# Altium project ZX_UNO_Aplus2.PrjPcb
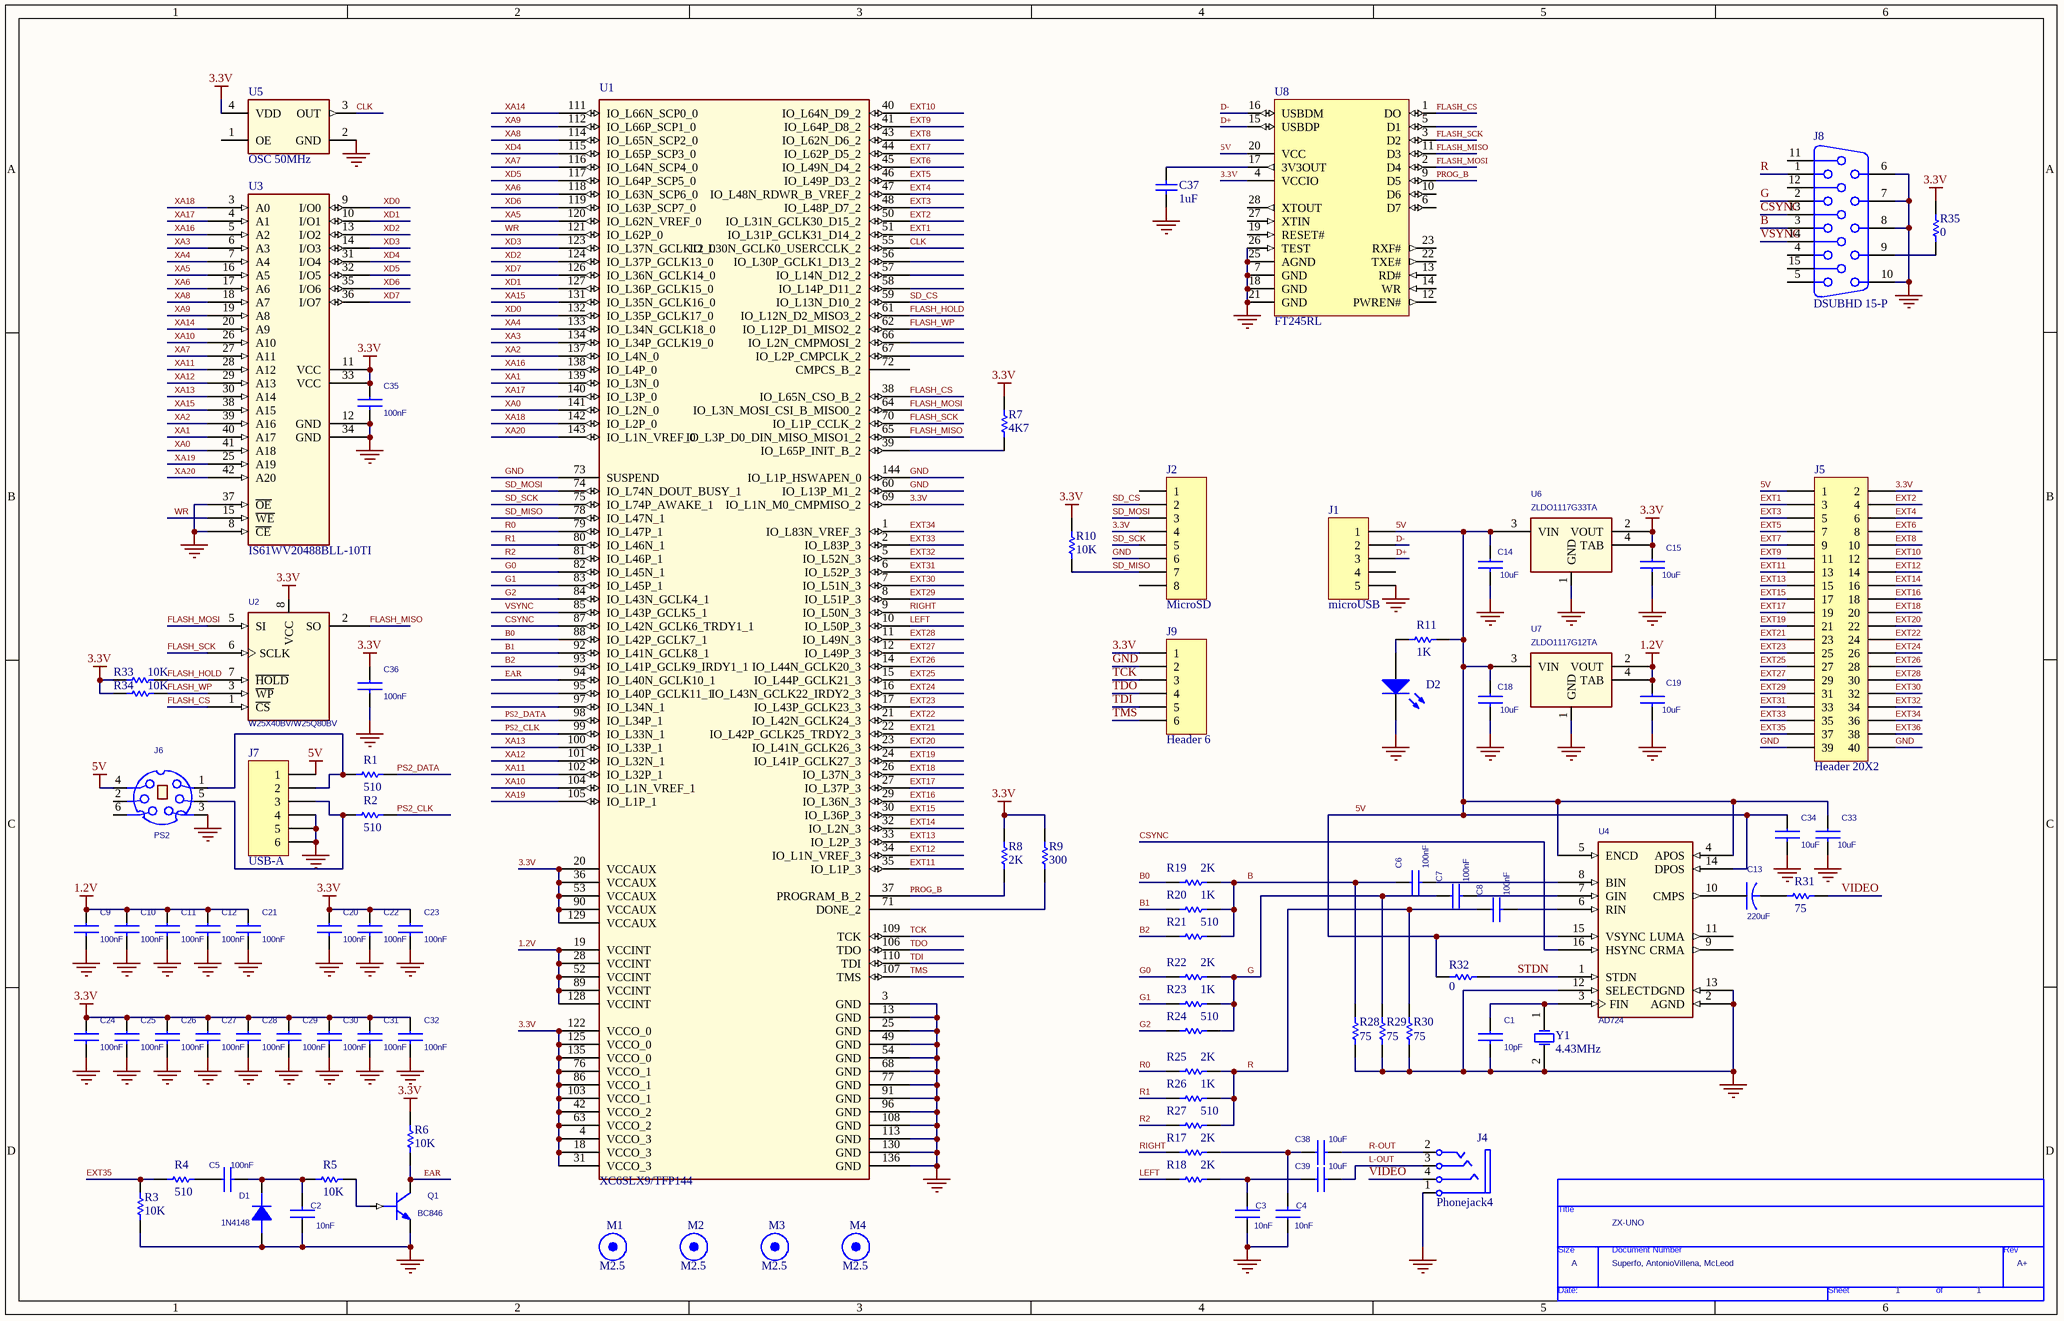
[diagram p0: ZX_UNO_Aplus2.SchDoc]
1 sheet, 92 parts. Net scope: global (net labels, ports and power ports of the same name join across sheets).
Board file: ZX_UNO_Aplus2.PcbDoc

## Sheet ZX_UNO_Aplus2.SchDoc
size 386 x 246 mm

### Parts
*  Page Count: 1  Page Size: A  Title: ZX-UNO  RevCode: A+  Doc: Superfo, AntonioVillena, McLeod  (hidden comment: TitleBlock0)  (graphical)
C1  10pF  [SM/C_0805]
C2  10nF  [SM/C_0805]
C3  10nF  [SM/C_0805]
C4  10nF  [SM/C_0805]
C5  100nF  [SM/C_0603]
C6  100nF  [SM/C_0603]
C7  100nF  [SM/C_0603]
C8  100nF  [SM/C_0603]
C9  100nF  [SM/C_0603]
C10  100nF  [SM/C_0603]
C11  100nF  [SM/C_0603]
C12  100nF  [SM/C_0603]
C13  220uF  [CYL/D.250/LS.150/.031]
C14  10uF  [SM/C_0805]
C15  10uF  [SM/C_0805]
C18  10uF  [SM/C_0805]
C19  10uF  [SM/C_0805]
C20  100nF  [SM/C_0603]
C21  100nF  [SM/C_0603]
C22  100nF  [SM/C_0603]
C23  100nF  [SM/C_0603]
C24  100nF  [SM/C_0603]
C25  100nF  [SM/C_0603]
C26  100nF  [SM/C_0603]
C27  100nF  [SM/C_0603]
C28  100nF  [SM/C_0603]
C29  100nF  [SM/C_0603]
C30  100nF  [SM/C_0603]
C31  100nF  [SM/C_0603]
C32  100nF  [SM/C_0603]
C33  10uF  [SM/C_0805]
C34  10uF  [SM/C_0805]
C35  100nF  [SM/C_0603]
C36  100nF  [SM/C_0603]
C37  value 1uF  [SM/C_0805]  (hidden comment: Cap)
C38  10uF  [SM/C_0805]
C39  10uF  [SM/C_0805]
D1  1N4148  [SM/D_0805_21]
D2  LED0  [SM/LED_0603_21]  (value not drawn)
J1  microUSB  [MICRO USB]
J2  MicroSD  [SD HR1941CT-ND]
J4  Phonejack4  [AUDIO JACK PJ-322]
J5  Header 20X2  [HDR2X20]
J6  PS2  [DINC/MIN_TM/6]
J7  USB-A  [USB A]
J8  DSUBHD 15-P  [DSUB/RP/SM/15]
J9  Header 6  [HDR1X6]
M1  M2.5  [M2.5]
M2  M2.5  [M2.5]
M3  M2.5  [M2.5]
M4  M2.5  [M2.5]
Q1  BC846  [SM/SOT23_231]
R1  value 510  [SM/R_0805]  (hidden comment: Res1)
R2  value 510  [SM/R_0805]  (hidden comment: Res1)
R3  value 10K  [SM/R_0805]  (hidden comment: Res1)
R4  value 510  [SM/R_0805]  (hidden comment: Res1)
R5  value 10K  [SM/R_0805]  (hidden comment: Res1)
R6  value 10K  [SM/R_0805]  (hidden comment: Res1)
R7  value 4K7  [SM/R_0805]  (hidden comment: Res1)
R8  value 2K  [SM/R_0805]  (hidden comment: Res1)
R9  value 300  [SM/R_0805]  (hidden comment: Res1)
R10  value 10K  [SM/R_0805]  (hidden comment: Res1)
R11  value 1K  [SM/R_0805]  (hidden comment: Res1)
R17  value 2K  [SM/R_0805]  (hidden comment: Res1)
R18  value 2K  [SM/R_0805]  (hidden comment: Res1)
R19  value 2K  [SM/R_0805]  (hidden comment: Res1)
R20  value 1K  [SM/R_0805]  (hidden comment: Res1)
R21  value 510  [SM/R_0805]  (hidden comment: Res1)
R22  value 2K  [SM/R_0805]  (hidden comment: Res1)
R23  value 1K  [SM/R_0805]  (hidden comment: Res1)
R24  value 510  [SM/R_0805]  (hidden comment: Res1)
R25  value 2K  [SM/R_0805]  (hidden comment: Res1)
R26  value 1K  [SM/R_0805]  (hidden comment: Res1)
R27  value 510  [SM/R_0805]  (hidden comment: Res1)
R28  value 75  [SM/R_0805]  (hidden comment: Res1)
R29  value 75  [SM/R_0805]  (hidden comment: Res1)
R30  value 75  [SM/R_0805]  (hidden comment: Res1)
R31  value 75  [SM/R_0805]  (hidden comment: Res1)
R32  value 0  [SM/R_0805]  (hidden comment: Res1)
R33  value 10K  [SM/R_0805]  (hidden comment: Res1)
R34  value 10K  [SM/R_0805]  (hidden comment: Res1)
R35  value 0  [SM/R_0805]  (hidden comment: Res1)
U1  XC6SLX9/TFP144
U2  W25X40BV/W25Q80BV  [SOJ.050/8/WB.300/L.200]
U3  IS61WV20488BLL-10TI  [SOP80P1176-44M]
U4  AD724  [SOJ.050/16/WB.400/L.400]
U5  OSC 50MHz  [SM/OSC]
U6  ZLDO1117G33TA  [SM/SOT223]
U7  ZLDO1117G12TA  [SM/SOT223]
U8  FT245RL  [SOP65P780-28N]
Y1  4.43MHz  [XTAL]

### Nets
1.2V: C9.1 C10.1 C11.1 C12.1 C19.1 C21.1 U1.19(VCCINT) U1.28(VCCINT) U1.52(VCCINT) U1.89(VCCINT) U1.128(VCCINT) U7.2(VOUT) U7.4(TAB)
3.3V: C15.1 C20.1 C22.1 C23.1 C24.1 C25.1 C26.1 C27.1 C28.1 C29.1 C30.1 C31.1 C32.1 C35.1 C36.1 J2.4 J5.2 J9.1 R6.1 R7.2 R8.2 R9.2 R10.2 R33.1 R34.1 R35.1 U1.4(VCCO_3) U1.18(VCCO_3) U1.20(VCCAUX) U1.31(VCCO_3) U1.36(VCCAUX) U1.42(VCCO_2) U1.53(VCCAUX) U1.63(VCCO_2) U1.69(IO_L1N_M0_CMPMISO_2) U1.76(VCCO_1) U1.86(VCCO_1) U1.90(VCCAUX) U1.103(VCCO_1) U1.122(VCCO_0) U1.125(VCCO_0) U1.129(VCCAUX) U1.135(VCCO_0) U2.8(VCC) U3.11(VCC) U3.33(VCC) U5.4(VDD) U6.2(VOUT) U6.4(TAB) U8.4(VCCIO)
5V: C14.1 C18.1 C33.1 C34.1 J1.1 J5.1 J6.4 J7.1 R11.1 R32.2 U4.4(APOS) U4.5(ENCD) U4.14(DPOS) U4.15(VSYNC) U6.3(VIN) U7.3(VIN) U8.20(VCC)
GND: C1.2 C2.1 C3.1 C4.1 C9.2 C10.2 C11.2 C12.2 C14.2 C15.2 C18.2 C19.2 C20.2 C21.2 C22.2 C23.2 C24.2 C25.2 C26.2 C27.2 C28.2 C29.2 C30.2 C31.2 C32.2 C33.2 C34.2 C35.2 C36.2 C37.2 D1.1(A) D2.2(K) J1.5 J2.6 J4.1(S) J5.39 J5.40 J6.3 J6.M1(GND) J6.M2(GND) J6.M3(GND) J7.4 J7.5 J7.6 J8.6 J8.7 J8.8 J8.10 J9.2 Q1.3(EMITTER) R3.2 R28.1 R29.1 R30.1 U1.3(GND) U1.13(GND) U1.25(GND) U1.49(GND) U1.54(GND) U1.60(IO_L13P_M1_2) U1.68(GND) U1.73(SUSPEND) U1.77(GND) U1.91(GND) U1.96(GND) U1.108(GND) U1.113(GND) U1.130(GND) U1.136(GND) U1.144(IO_L1P_HSWAPEN_0) U2.4(GND) U3.8(~{CE}) U3.12(GND) U3.34(GND) U3.37(~{OE}) U4.2(AGND) U4.12(SELECT) U4.13(DGND) U5.2(GND) U6.1(GND) U7.1(GND) U8.7(GND) U8.18(GND) U8.21(GND) U8.25(AGND) U8.26(TEST) Y1.2(OSC2)
B: C6.1 J8.3 R19.2 R20.2 R21.2 R28.2
B0: R19.1 U1.88(IO_L42P_GCLK7_1)
B1: R20.1 U1.92(IO_L41N_GCLK8_1)
B2: R21.1 U1.93(IO_L41P_GCLK9_IRDY1_1)
CLK: U1.55(IO_L30N_GCLK0_USERCCLK_2) U5.3(OUT)
CSYNC: J8.13 U1.87(IO_L42N_GCLK6_TRDY1_1) U4.16(HSYNC)
D+: J1.3 U8.15(USBDP)
D-: J1.2 U8.16(USBDM)
EAR: Q1.1(COLLECTOR) R6.2 U1.94(IO_L40N_GCLK10_1)
EXT1: J5.3 U1.51(IO_L31P_GCLK31_D14_2)
EXT2: J5.4 U1.50(IO_L31N_GCLK30_D15_2)
EXT3: J5.5 U1.48(IO_L48P_D7_2)
EXT4: J5.6 U1.47(IO_L48N_RDWR_B_VREF_2)
EXT5: J5.7 U1.46(IO_L49P_D3_2)
EXT6: J5.8 U1.45(IO_L49N_D4_2)
EXT7: J5.9 U1.44(IO_L62P_D5_2)
EXT8: J5.10 U1.43(IO_L62N_D6_2)
EXT9: J5.11 U1.41(IO_L64P_D8_2)
EXT10: J5.12 U1.40(IO_L64N_D9_2)
EXT11: J5.13 U1.35(IO_L1P_3)
EXT12: J5.14 U1.34(IO_L1N_VREF_3)
EXT13: J5.15 U1.33(IO_L2P_3)
EXT14: J5.16 U1.32(IO_L2N_3)
EXT15: J5.17 U1.30(IO_L36P_3)
EXT16: J5.18 U1.29(IO_L36N_3)
EXT17: J5.19 U1.27(IO_L37P_3)
EXT18: J5.20 U1.26(IO_L37N_3)
EXT19: J5.21 U1.24(IO_L41P_GCLK27_3)
EXT20: J5.22 U1.23(IO_L41N_GCLK26_3)
EXT21: J5.23 U1.22(IO_L42P_GCLK25_TRDY2_3)
EXT22: J5.24 U1.21(IO_L42N_GCLK24_3)
EXT23: J5.25 U1.17(IO_L43P_GCLK23_3)
EXT24: J5.26 U1.16(IO_L43N_GCLK22_IRDY2_3)
EXT25: J5.27 U1.15(IO_L44P_GCLK21_3)
EXT26: J5.28 U1.14(IO_L44N_GCLK20_3)
EXT27: J5.29 U1.12(IO_L49P_3)
EXT28: J5.30 U1.11(IO_L49N_3)
EXT29: J5.31 U1.8(IO_L51P_3)
EXT30: J5.32 U1.7(IO_L51N_3)
EXT31: J5.33 U1.6(IO_L52P_3)
EXT32: J5.34 U1.5(IO_L52N_3)
EXT33: J5.35 U1.2(IO_L83P_3)
EXT34: J5.36 U1.1(IO_L83N_VREF_3)
EXT35: J5.37 R3.1 R4.1
EXT36: J5.38
FLASH_CS: U1.38(IO_L65N_CSO_B_2) U2.1(~{CS}) U8.1(DO)
FLASH_HOLD: R33.2 U1.61(IO_L12N_D2_MISO3_2) U2.7(~{HOLD})
FLASH_MISO: U1.65(IO_L3P_D0_DIN_MISO_MISO1_2) U2.2(SO) U8.11(D3)
FLASH_MOSI: U1.64(IO_L3N_MOSI_CSI_B_MISO0_2) U2.5(SI) U8.2(D4)
FLASH_SCK: U1.70(IO_L1P_CCLK_2) U2.6(SCLK) U8.3(D2)
FLASH_WP: R34.2 U1.62(IO_L12P_D1_MISO2_2) U2.3(~{WP})
G: C7.1 J8.2 R22.2 R23.2 R24.2 R29.2
G0: R22.1 U1.82(IO_L45N_1)
G1: R23.1 U1.83(IO_L45P_1)
G2: R24.1 U1.84(IO_L43N_GCLK4_1)
L-OUT: C39.2 J4.3(RN)
LEFT: R18.1 U1.10(IO_L50P_3)
PROG_B: R8.1 U1.37(PROGRAM_B_2) U8.9(D5)
PS2_CLK: R2.2 U1.99(IO_L33N_1)
PS2_DATA: R1.2 U1.98(IO_L34P_1)
R: C8.1 J8.1 R25.2 R26.2 R27.2 R30.2
R0: R25.1 U1.79(IO_L47P_1)
R1: R26.1 U1.80(IO_L46N_1)
R2: R27.1 U1.81(IO_L46P_1)
R-OUT: C38.2 J4.2(T)
RIGHT: R17.1 U1.9(IO_L50N_3)
SD_CS: J2.2 U1.59(IO_L13N_D10_2)
SD_MISO: J2.7 R10.1 U1.78(IO_L47N_1)
SD_MOSI: J2.3 U1.74(IO_L74N_DOUT_BUSY_1)
SD_SCK: J2.5 U1.75(IO_L74P_AWAKE_1)
STDN: R32.1 U4.1(STDN)
TCK: J9.3 U1.109(TCK)
TDI: J9.5 U1.110(TDI)
TDO: J9.4 U1.106(TDO)
TMS: J9.6 U1.107(TMS)
VIDEO: J4.4(R) R31.2
VSYNC: J8.14 U1.85(IO_L43P_GCLK5_1)
WR: U1.121(IO_L62P_0) U3.15(~{WE})
XA0: U1.141(IO_L2N_0) U3.41(A18)
XA1: U1.139(IO_L3N_0) U3.40(A17)
XA2: U1.137(IO_L4N_0) U3.39(A16)
XA3: U1.134(IO_L34P_GCLK19_0) U3.6(A3)
XA4: U1.133(IO_L34N_GCLK18_0) U3.7(A4)
XA5: U1.120(IO_L62N_VREF_0) U3.16(A5)
XA6: U1.118(IO_L63N_SCP6_0) U3.17(A6)
XA7: U1.116(IO_L64N_SCP4_0) U3.27(A11)
XA8: U1.114(IO_L65N_SCP2_0) U3.18(A7)
XA9: U1.112(IO_L66P_SCP1_0) U3.19(A8)
XA10: U1.104(IO_L1N_VREF_1) U3.26(A10)
XA11: U1.102(IO_L32P_1) U3.28(A12)
XA12: U1.101(IO_L32N_1) U3.29(A13)
XA13: U1.100(IO_L33P_1) U3.30(A14)
XA14: U1.111(IO_L66N_SCP0_0) U3.20(A9)
XA15: U1.131(IO_L35N_GCLK16_0) U3.38(A15)
XA16: U1.138(IO_L4P_0) U3.5(A2)
XA17: U1.140(IO_L3P_0) U3.4(A1)
XA18: U1.142(IO_L2P_0) U3.3(A0)
XA19: U1.105(IO_L1P_1) U3.25(A19)
XA20: U1.143(IO_L1N_VREF_0) U3.42(A20)
XD0: U1.132(IO_L35P_GCLK17_0) U3.9(I/O0)
XD1: U1.127(IO_L36P_GCLK15_0) U3.10(I/O1)
XD2: U1.124(IO_L37P_GCLK13_0) U3.13(I/O2)
XD3: U1.123(IO_L37N_GCLK12_0) U3.14(I/O3)
XD4: U1.115(IO_L65P_SCP3_0) U3.31(I/O4)
XD5: U1.117(IO_L64P_SCP5_0) U3.32(I/O5)
XD6: U1.119(IO_L63P_SCP7_0) U3.35(I/O6)
XD7: U1.126(IO_L36N_GCLK14_0) U3.36(I/O7)
NetC1_1: C1.1 U4.3(FIN) Y1.1(OSC1)
NetC2_2: C2.2 C5.2 D1.2(K) R5.1
NetC3_2: C3.2 C39.1 R18.2
NetC4_2: C4.2 C38.1 R17.2
NetC5_1: C5.1 R4.2
NetC6_2: C6.2 U4.8(BIN)
NetC7_2: C7.2 U4.7(GIN)
NetC8_2: C8.2 U4.6(RIN)
NetC13_1: C13.1 U4.10(CMPS)
NetC13_2: C13.2 R31.1
NetC37_1: C37.1 U8.17(3V3OUT)
NetD2_1: D2.1(A) R11.2
NetJ6_1: J6.1 J7.2 R1.1
NetJ6_5: J6.5 J7.3 R2.1
NetJ8_9: J8.9 R35.2
NetQ1_2: Q1.2(BASE) R5.2
NetR7_1: R7.1 U1.39(IO_L65P_INIT_B_2)
NetR9_1: R9.1 U1.71(DONE_2)

Not connected (* = marked no-connect by the designer): J1 4; J2 1 8; J6 2 6; J8 4 5 11 12 15; U1 56(IO_L30P_GCLK1_D13_2) 57(IO_L14N_D12_2) 58(IO_L14P_D11_2) 66(IO_L2N_CMPMOSI_2) 67(IO_L2P_CMPCLK_2) 72(CMPCS_B_2) 95(IO_L40P_GCLK11_1) 97(IO_L34N_1); U4 9(CRMA) 11(LUMA); U5 1(OE); U8 5(D1) 6(D7) 10(D6) 12(PWREN#) 13(RD#) 14(WR) 19(RESET#) 22(TXE#) 23(RXF#) 27(XTIN) 28(XTOUT)

### Notes on the sheet
- (in symbol TitleBlock0) Title; Size; Document Number; Rev; Date:; Sheet; of

### Library data of the parts
C1-C5 C7 C36 = CAP NP: COMPHEIGHT: 0.000; MEMORY: NO; COMPGROUP: 0; COMPLOC: [1025.000,1280.000]; COMPSIDE: BOT; FPLIST: SM/C_0603_VIA,SM/C_0805,SM/C_0603; DECOUPLER: NO; COMPKEY: NO; COMPLOCKED: NO; COMPFIXED: NO; COMPROT: 0
C6 C8 = CAP NP: FPLIST: SM/C_0603_VIA,SM/C_0805,SM/C_0603; COMPSIDE: BOT; COMPLOC: [1025.000,1280.000]; COMPROT: 0; COMPFIXED: NO; COMPHEIGHT: 0.000; COMPGROUP: 0; COMPLOCKED: NO; COMPKEY: NO; DECOUPLER: NO; MEMORY: NO
C9 = CAP NP: FPLIST: SM/C_0603_VIA,SM/C_0805,SM/C_0603,SM/C_0603_VIA1; COMPSIDE: BOT; COMPLOC: [1820.000,1500.000]; COMPROT: 180; COMPGROUP: 0; COMPFIXED: NO; COMPHEIGHT: 0.000; COMPLOCKED: NO; COMPKEY: NO; DECOUPLER: NO; MEMORY: NO
C10 = CAP NP: FPLIST: SM/C_0805,SM/C_0603; COMPSIDE: BOT; COMPLOC: [1255.000,1345.000]; COMPROT: 90; COMPGROUP: 0; COMPFIXED: NO; COMPHEIGHT: 0.000; COMPLOCKED: NO; COMPKEY: NO; DECOUPLER: NO; MEMORY: NO
C11 = CAP NP: FPLIST: SM/C_0603,SM/C_0805,SM/C_0603_VIA; COMPSIDE: BOT; COMPLOC: [1440.000,795.000]; COMPROT: 180; COMPGROUP: 0; COMPFIXED: NO; COMPHEIGHT: 0.000; COMPLOCKED: NO; COMPKEY: NO; DECOUPLER: NO; MEMORY: NO
C12 = CAP NP: FPLIST: SM/C_0805,SM/C_0603,SM/C_0603_VIA,SM/C_0603_VIA1,SM/C_0603_VIA2; COMPSIDE: BOT; COMPLOC: [1965.000,916.000]; COMPROT: 90; COMPGROUP: 0; COMPFIXED: NO; COMPHEIGHT: 0.000; COMPLOCKED: NO; COMPKEY: NO; DECOUPLER: NO; MEMORY: NO
C13 = CAP: COMPSIDE: TOP; COMPLOC: [2160.000,2000.000]; COMPROT: 270; COMPGROUP: 0; COMPFIXED: NO; COMPHEIGHT: 0.000; COMPLOCKED: NO; COMPKEY: NO; DECOUPLER: NO; MEMORY: NO
C14 = CAP NP: COMPHEIGHT: 0.000; MEMORY: NO; COMPGROUP: 0; COMPLOC: [340.000,620.000]; COMPSIDE: TOP; FPLIST: SM/C_0805_VIA,SM/C_0805_VIA1,SM/C_0603,SM/C_0805; DECOUPLER: NO; COMPKEY: NO; COMPLOCKED: NO; COMPFIXED: NO; COMPROT: 0
C15 = CAP NP: FPLIST: SM/C_0805,SM/C_0603_VIA,SM/C_0603,SM/C_0805_VIA; COMPSIDE: TOP; COMPLOC: [250.000,620.000]; COMPROT: 180; COMPGROUP: 0; COMPFIXED: NO; COMPHEIGHT: 0.000; COMPLOCKED: NO; COMPKEY: NO; DECOUPLER: NO; MEMORY: NO
C18 = CAP NP: COMPHEIGHT: 0.000; MEMORY: NO; COMPGROUP: 0; COMPLOC: [1485.000,1660.000]; COMPSIDE: BOT; FPLIST: SM/C_0805_VIA2,SM/C_0805_VIA,SM/C_0805_VIA1,SM/C_0603,SM/C_0805; DECOUPLER: NO; COMPKEY: NO; COMPLOCKED: NO; COMPFIXED: NO; COMPROT: 0
C19 = CAP NP: FPLIST: SM/C_0805_VIA2,SM/C_0805,SM/C_0603_VIA,SM/C_0603,SM/C_0805_VIA; COMPSIDE: BOT; COMPLOC: [1575.000,1660.000]; COMPROT: 180; COMPGROUP: 0; COMPFIXED: NO; COMPHEIGHT: 0.000; COMPLOCKED: NO; COMPKEY: NO; DECOUPLER: NO; MEMORY: NO
C20 = CAP NP: FPLIST: SM/C_0603_VIA,SM/C_0603,SM/C_0805,SM/C_0603_VIA1; COMPSIDE: BOT; COMPLOC: [1345.000,1500.000]; COMPROT: 0; COMPFIXED: NO; COMPHEIGHT: 0.000; COMPGROUP: 0; COMPLOCKED: NO; COMPKEY: NO; DECOUPLER: NO; MEMORY: NO
C21 = CAP NP: FPLIST: SM/C_0805,SM/C_0603,SM/C_0603_VIA; COMPSIDE: BOT; COMPLOC: [1255.000,910.000]; COMPROT: 90; COMPGROUP: 0; COMPFIXED: NO; COMPHEIGHT: 0.000; COMPLOCKED: NO; COMPKEY: NO; DECOUPLER: NO; MEMORY: NO
C22 = CAP NP: FPLIST: SM/C_0805,SM/C_0603,SM/C_0603_VIA; COMPSIDE: BOT; COMPLOC: [1874.000,795.000]; COMPROT: 180; COMPGROUP: 0; COMPFIXED: NO; COMPHEIGHT: 0.000; COMPLOCKED: NO; COMPKEY: NO; DECOUPLER: NO; MEMORY: NO
C23 = CAP NP: FPLIST: SM/C_0603,SM/C_0805; COMPSIDE: BOT; COMPLOC: [1965.000,1335.000]; COMPROT: 90; COMPGROUP: 0; COMPFIXED: NO; COMPHEIGHT: 0.000; COMPLOCKED: NO; COMPKEY: NO; DECOUPLER: NO; MEMORY: NO
C24 = CAP NP: FPLIST: SM/C_0603_VIA1,SM/C_0603,SM/C_0805,SM/C_0603_VIA; COMPSIDE: BOT; COMPLOC: [1695.000,1500.000]; COMPROT: 180; COMPGROUP: 0; COMPFIXED: NO; COMPHEIGHT: 0.000; COMPLOCKED: NO; COMPKEY: NO; DECOUPLER: NO; MEMORY: NO
C25 = CAP NP: FPLIST: SM/C_0805,SM/C_0603; COMPSIDE: BOT; COMPLOC: [1415.000,1500.000]; COMPROT: 180; COMPGROUP: 0; COMPFIXED: NO; COMPHEIGHT: 0.000; COMPLOCKED: NO; COMPKEY: NO; DECOUPLER: NO; MEMORY: NO
C26 = CAP NP: FPLIST: SM/C_0805,SM/C_0603; COMPSIDE: BOT; COMPLOC: [1375.000,795.000]; COMPROT: 0; COMPFIXED: NO; COMPHEIGHT: 0.000; COMPGROUP: 0; COMPLOCKED: NO; COMPKEY: NO; DECOUPLER: NO; MEMORY: NO
C27 = CAP NP: FPLIST: SM/C_0603,SM/C_0805; COMPSIDE: BOT; COMPLOC: [1255.000,985.000]; COMPROT: 270; COMPGROUP: 0; COMPFIXED: NO; COMPHEIGHT: 0.000; COMPLOCKED: NO; COMPKEY: NO; DECOUPLER: NO; MEMORY: NO
C28 = CAP NP: FPLIST: SM/C_0603,SM/C_0805,SM/C_0603_VIA; COMPSIDE: BOT; COMPLOC: [1695.000,1325.000]; COMPROT: 0; COMPFIXED: NO; COMPHEIGHT: 0.000; COMPGROUP: 0; COMPLOCKED: NO; COMPKEY: NO; DECOUPLER: NO; MEMORY: NO
C29 = CAP NP: FPLIST: SM/C_0603_VIA1,SM/C_0603_VIA,SM/C_0805,SM/C_0603; COMPSIDE: BOT; COMPLOC: [1255.000,1220.000]; COMPROT: 90; COMPGROUP: 0; COMPFIXED: NO; COMPHEIGHT: 0.000; COMPLOCKED: NO; COMPKEY: NO; DECOUPLER: NO; MEMORY: NO
C30 = CAP NP: FPLIST: SM/C_0805,SM/C_0603; COMPSIDE: BOT; COMPLOC: [1805.000,795.000]; COMPROT: 0; COMPFIXED: NO; COMPHEIGHT: 0.000; COMPGROUP: 0; COMPLOCKED: NO; COMPKEY: NO; DECOUPLER: NO; MEMORY: NO
C31 = CAP NP: FPLIST: SM/C_0603,SM/C_0805,SM/C_0603_VIA,SM/C_0603_VIA1,SM/C_0603_VIA2; COMPSIDE: BOT; COMPLOC: [1965.000,1040.000]; COMPROT: 90; COMPGROUP: 0; COMPFIXED: NO; COMPHEIGHT: 0.000; COMPLOCKED: NO; COMPKEY: NO; DECOUPLER: NO; MEMORY: NO
C32 = CAP NP: COMPHEIGHT: 0.000; MEMORY: NO; COMPGROUP: 0; COMPROT: 270; COMPLOC: [1965.000,1404.000]; COMPSIDE: BOT; FPLIST: SM/C_0805,SM/C_0603,SM/C_0603_VIA; DECOUPLER: NO; COMPKEY: NO; COMPLOCKED: NO; COMPFIXED: NO
C33 = CAP NP: FPLIST: SM/C_0805_VIA2,SM/C_0805,SM/C_0603_VIA,SM/C_0603,SM/C_0805_VIA; COMPSIDE: BOT; COMPLOC: [720.000,260.000]; COMPROT: 270; COMPGROUP: 0; COMPFIXED: NO; COMPHEIGHT: 0.000; COMPLOCKED: NO; COMPKEY: NO; DECOUPLER: NO; MEMORY: NO
C34 C38 C39 = CAP NP: COMPHEIGHT: 0.000; MEMORY: NO; COMPGROUP: 0; COMPROT: 270; COMPLOC: [905.000,360.000]; COMPSIDE: BOT; FPLIST: SM/C_0603,SM/C_0805; DECOUPLER: NO; COMPKEY: NO; COMPLOCKED: NO; COMPFIXED: NO
C35 = CAP NP: COMPHEIGHT: 0.000; MEMORY: NO; COMPGROUP: 0; COMPROT: 90; COMPLOC: [2732.000,1527.000]; COMPSIDE: TOP; FPLIST: SM/C_0603_VIA2,SM/C_0603_VIA,SM/C_0805,SM/C_0603; DECOUPLER: NO; COMPKEY: NO; COMPLOCKED: NO; COMPFIXED: NO
C37 = Cap: Capacitor; Published: 8-Jun-2000; LatestRevisionDate: 17-Jul-2002; LatestRevisionNote: Re-released for DXP Platform.; PackageReference: RAD-0.3; Publisher: Altium Limited
D1 = DIODE: COMPHEIGHT: 0.000; MEMORY: NO; COMPGROUP: 0; COMPROT: 180; COMPLOC: [2505.000,640.000]; COMPSIDE: BOT; DECOUPLER: NO; COMPKEY: NO; COMPLOCKED: NO; COMPFIXED: NO
D2 = LED0: Typical INFRARED GaAs LED; Published: 8-Jun-2000; LatestRevisionDate: 08-Jul-2005; LatestRevisionNote: Mech Layer 1 removed.; PackageReference: LED-0; Publisher: Altium Limited; PackageDescription: LED; 2 Leads
J1 = Header 5: Header, 5-Pin; LatestRevisionDate: 17-Jul-2002; LatestRevisionNote: Re-released for DXP Platform.; Publisher: Altium Limited
J2 = Header 8: Header, 8-Pin; LatestRevisionDate: 17-Jul-2002; LatestRevisionNote: Re-released for DXP Platform.; Publisher: Altium Limited
J4 = Phonejack4: Jack Socket, 3.5mm, Thru-Hole, Right Angle, 4-Conductor; PackageDocument: 2003; PCB_Layout: Complies with manufacturer's recommendation.; DrillAndSlotSize: Corresponds to nominal value.; Published: 15-Jul-2004; DatasheetDocument: 2003; PackageReference: S1VS_SBS; Publisher: Altium Limited; ComponentLink1Description: Manufacturer Link; ComponentLink1URL: http://www.cliffuk.co.uk/
J5 = Header 20X2: Header, 20-Pin, Dual row; LatestRevisionDate: 17-Jul-2002; LatestRevisionNote: Re-released for DXP Platform.; Publisher: Altium Limited
J6 = M-DIN 8: COMPHEIGHT: 512.000; MEMORY: NO; COMPFIXED: YES; COMPGROUP: 0; COMPROT: 270; COMPLOC: [3385.533,373.983]; COMPSIDE: TOP; DECOUPLER: NO; COMPKEY: NO; COMPLOCKED: NO
J7 J9 = Header 6: Header, 6-Pin; LatestRevisionDate: 17-Jul-2002; LatestRevisionNote: Re-released for DXP Platform.; Publisher: Altium Limited
J8 = DSUBHD 15-P: Receptacle Assembly, 15-Pin, Sim Line Connector; PackageDocument: B; Positions: 15; Gender: Receptacle Header; Published: 15-Jun-2001; LatestRevisionDate: 17-Jul-2002; LatestRevisionNote: Re-released for DXP Platform.; DatasheetDocument: 24-Nov-1999; PackageReference: 788574; Publisher: Altium Limited; Orientation: Right Angle
Q1 = BC547: COMPHEIGHT: 0.000; MEMORY: NO; COMPGROUP: 0; COMPLOC: [2215.000,625.000]; COMPSIDE: BOT; FPLIST: SM/SOT23_123; DECOUPLER: NO; COMPKEY: NO; COMPLOCKED: NO; COMPFIXED: NO; COMPROT: 0
R1-R11 R17-R35 = Res1: Resistor; Published: 8-Jun-2000; LatestRevisionDate: 17-Jul-2002; LatestRevisionNote: Re-released for DXP Platform.; PackageReference: AXIAL-0.3; Publisher: Altium Limited
U2 = FLASH-25XX: COMPHEIGHT: 0.000; MEMORY: NO; COMPGROUP: 0; COMPROT: 180; COMPLOC: [950.000,1185.000]; COMPSIDE: BOT; DECOUPLER: NO; COMPKEY: NO; COMPLOCKED: NO; COMPFIXED: NO
U4 = AD724: COMPHEIGHT: 0.000; MEMORY: NO; COMPGROUP: 0; COMPROT: 90; COMPLOC: [1000.000,210.000]; COMPSIDE: TOP; DECOUPLER: NO; COMPKEY: NO; COMPLOCKED: NO; COMPFIXED: NO
U5 = OSC
U6 U7 = REGULATOR-1: COMPHEIGHT: 0.000; MEMORY: NO; COMPGROUP: 0; COMPLOC: [1665.000,1750.000]; COMPSIDE: BOT; DECOUPLER: NO; COMPKEY: NO; COMPLOCKED: NO; COMPFIXED: NO; COMPROT: 0
U8 = FT245RL: USB/Parallel FIFO Bi-Directional Data Transfer Chip, LQFP-32, Pb-Free; Published: 6-Jun-2005; LatestRevisionDate: 13-Apr-2006; LatestRevisionNote: IPC-7351 Footprint Added.; DatasheetVersion: ver 1.6, Feb-2005; PackageVersion: Mar-2004; PackageReference: LQFP-32; Publisher: Altium Limited; PackageDescription: 32-Pin Thin Quad Flat Pack 0.8 mm Pitch; ComponentLink1Description: Manufacturer Link; ComponentLink1URL: http://www.ftdichip.com/Products/FT245BM.htm; ComponentLink2Description: Datasheet; ComponentLink2URL: http://www.ftdichip.com/Documents/DataSheets/ds245bl16.pdf
Y1 = XTAL: Crystal Oscillator; Published: 8-Jun-2000; LatestRevisionDate: 17-Jul-2002; LatestRevisionNote: Re-released for DXP Platform.; PackageReference: R38; Publisher: Altium Limited
* = TitleBlock0: Page Number: 1; Page Create Date: March  8, 1995